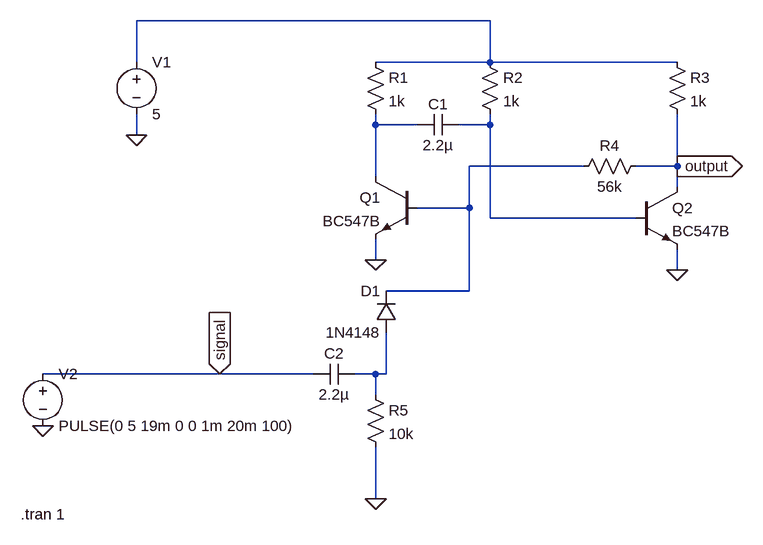
[diagram p0: schematic monostable_multivibrator.asc]
monostable_multivibrator.asc, the LTspice schematic file:
Version 4
SHEET 1 880 680
WIRE 176 -576 -368 -576
WIRE -368 -512 -368 -576
WIRE 176 -512 176 -576
WIRE 176 -512 0 -512
WIRE 464 -512 176 -512
WIRE 0 -416 0 -432
WIRE 64 -416 0 -416
WIRE 176 -416 176 -432
WIRE 176 -416 128 -416
WIRE -368 -400 -368 -432
WIRE 320 -352 144 -352
WIRE 464 -352 464 -432
WIRE 464 -352 400 -352
WIRE 0 -336 0 -416
WIRE 464 -320 464 -352
WIRE 144 -288 144 -352
WIRE 144 -288 64 -288
WIRE 176 -272 176 -416
WIRE 400 -272 176 -272
WIRE 0 -208 0 -240
WIRE 464 -192 464 -224
WIRE 144 -160 144 -288
WIRE 144 -160 16 -160
WIRE -240 -32 -512 -32
WIRE -96 -32 -240 -32
WIRE 0 -32 -32 -32
WIRE 16 -32 16 -96
WIRE 16 -32 0 -32
WIRE 0 0 0 -32
WIRE 0 160 0 80
FLAG 0 160 0
FLAG -368 -400 0
FLAG 0 -208 0
FLAG 464 -192 0
FLAG -240 -32 signal
IOPIN -240 -32 In
FLAG 464 -352 output
IOPIN 464 -352 Out
FLAG -512 48 0
SYMBOL cap 128 -432 R90
WINDOW 0 0 32 VBottom 2
WINDOW 3 32 32 VTop 2
SYMATTR InstName C1
SYMATTR Value 2.2µ
SYMBOL res -16 -528 R0
SYMATTR InstName R1
SYMATTR Value 1k
SYMBOL res 160 -528 R0
SYMATTR InstName R2
SYMATTR Value 1k
SYMBOL res 448 -528 R0
SYMATTR InstName R3
SYMATTR Value 1k
SYMBOL res 416 -368 R90
WINDOW 0 0 56 VBottom 2
WINDOW 3 32 56 VTop 2
SYMATTR InstName R4
SYMATTR Value 56k
SYMBOL cap -32 -48 R90
WINDOW 0 0 32 VBottom 2
WINDOW 3 32 32 VTop 2
SYMATTR InstName C2
SYMATTR Value 2.2µ
SYMBOL res -16 -16 R0
SYMATTR InstName R5
SYMATTR Value 10k
SYMBOL npn 64 -336 M0
SYMATTR InstName Q1
SYMATTR Value BC547B
SYMBOL diode 32 -96 R180
WINDOW 0 24 64 Left 2
WINDOW 3 24 0 Left 2
SYMATTR InstName D1
SYMATTR Value 1N4148
SYMBOL npn 400 -320 R0
SYMATTR InstName Q2
SYMATTR Value BC547B
SYMBOL voltage -368 -528 R0
WINDOW 123 0 0 Left 0
WINDOW 39 0 0 Left 0
SYMATTR InstName V1
SYMATTR Value 5
SYMBOL voltage -512 -48 R0
WINDOW 123 0 0 Left 0
WINDOW 39 0 0 Left 0
SYMATTR InstName V2
SYMATTR Value PULSE(0 5 19m 0 0 1m 20m 100)
TEXT -546 184 Left 2 !.tran 1

The netlist it stands for:
* monostable_multivibrator.asc
C1 N003 N002 2.2µ
R1 N001 N002 1k
R2 N001 N003 1k
R3 N001 output 1k
R4 output N004 56k
C2 N005 signal 2.2µ
R5 N005 0 10k
Q1 N002 N004 0 0 BC547B
D1 N005 N004 1N4148
Q2 output N003 0 0 BC547B
V1 N001 0 5
V2 signal 0 PULSE(0 5 19m 0 0 1m 20m 100)
.model D D
.lib standard.dio
.model NPN NPN
.model PNP PNP
.lib standard.bjt
.tran 1
.backanno
.end